# Altium schematic sheet switch_profet_btt62001.SchDoc
size A; SheetNumber: 15
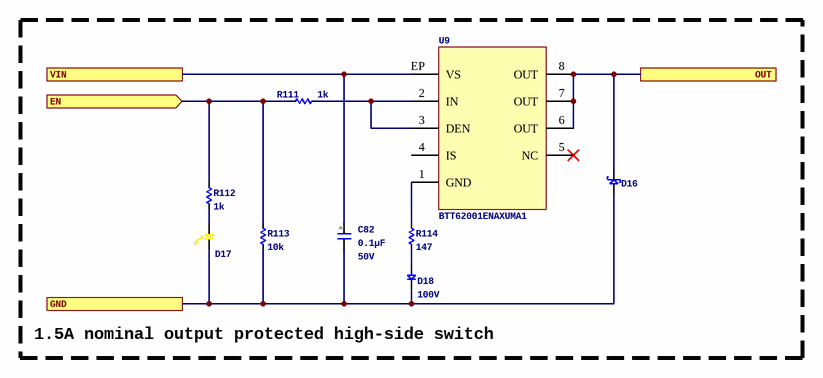
[diagram p0: switch_profet_btt62001.SchDoc]

## Parts
C82  Capacitance: 0.1µF  Voltage - Rated: 50V  [C0402_0.55MM]  (hidden comment: CGA2B3X7R1H104M050BB)
D16  15MQ040NPBF  [SMA]  (value not drawn)
D17  LTST-C190YKT  [LED_0603P_YELLOW]  (value not drawn)
D18  Voltage - DC Reverse (Vr) (Max): 100V  [SOD123]  (hidden comment: 1N4148W-TP)
R111  Resistance: 1k  [R0402_0.40MM]
R112  Resistance: 1k  [R0402_0.40MM]  (hidden comment: ERJ-2RKF1001X)
R113  Resistance: 10k  [R0402_0.40MM]
R114  Resistance: 147  [R0402_0.40MM]  (hidden comment: ERJ-2RKF1470X)
U9  BTT62001ENAXUMA1  [PG-TDSO-8-31]

## Blocks framed on the sheet
1.5A nominal output protected high-side switch: C82 D16-D18 R111-R114 U9

## Ports
EN (in), GND, OUT, VIN

## Nets
EN: R111.2 R112.2 R113.2 ; port EN
GND: C82.2 D16.1 D17.1 D18.2 R113.1 ; port GND
OUT: D16.2 U9.6(OUT) U9.7(OUT) U9.8(OUT) ; port OUT
VIN: C82.1 U9.EP(VS) ; port VIN
NetD17_2: D17.2 R112.1
NetD18_1: D18.1 R114.1
NetR111_1: R111.1 U9.2(IN) U9.3(DEN)
NetR114_2: R114.2 U9.1(GND)

Not connected (* = marked no-connect by the designer): U9 4(IS) 5(NC)*

## Notes on the sheet
- (in symbol CGA2B3X7R1H104M050BB) A

## Library data of the parts
C82 = CGA2B3X7R1H104M050BB: CAP CER 0.1UF 50V X7R 0402; Manufacturer: TDK Corporation; Unit Price (USD): 0.17; Tolerance: ±20%; ComponentLink1URL: https://product.tdk.com/info/en/catalog/datasheets/mlcc_automotive_general_en.pdf?ref_disty=digikey; ComponentLink1Description: Series Datasheet; Series: CGA; Part Status: Active; Temperature Coefficient: X7R; Operating Temperature: -55°C ~ 125°C; Applications: AEC-Q200; Mounting Type: Surface Mount, MLCC; Package / Case: 0402 (1005 Metric); Size / Dimension: 0.039" L x 0.020" W (1.00mm x 0.50mm); Thickness (Max): 0.022" (0.55mm); Supplier 1: Digikey; Supplier Part Number 1: 445-12271-1-ND; Manufacturer Part Number: CGA2B3X7R1H104M050BB
D16 = SCHOTTKY_15MQ040NPBF: DIODE SCHOTTKY 40V 3A SMA; Manufacturer: Vishay Semiconductor Diodes Division; Supplier 1: Digikey; ComponentLink1URL: https://www.vishay.com/docs/94141/vs-15mq040ntrpbf.pdf; ComponentLink1Description: Datasheet; Supplier Part Number 1: 15MQ040NPBF-ND; Manufacturer Part Number: 15MQ040NPBF
D17 = LED_0603_YELLOW_LTST-C190YKT: LED YELLOW CLEAR 0603 SMD; Manufacturer: Lite-On Inc; Supplier 1: Digikey; ComponentLink1URL: https://mm.digikey.com/Volume0/opasdata/d220001/medias/docus/1176/LTST-C190YKT.pdf; ComponentLink1Description: Datasheet; Supplier Part Number 1: 160-1184-1-ND; Manufacturer Part Number: LTST-C190YKT; Supplier 2: LCSC; Supplier Part Number 2: C125097
D18 = DIODE_1N4148WTPMSTR: DIODE SWITCH 100V 150MA SOD123; Manufacturer: Micro Commercial Co; Diode Type: Standard; Speed: Small Signal =< 200mA (Io), Any Speed; Reverse Recovery Time (trr): 4ns; Current - Reverse Leakage @ Vr: 1µA @ 75V; Capacitance @ Vr, F: 2pF @ 0V, 1MHz; Voltage - Forward (Vf) (Max) @ If: 1.25V @ 150mA; Supplier 1: Digikey; Manufacturer Part Number: 1N4148W-TP; RoHS: RoHS Compliant; Category: Discrete Semiconductor Products; Stock 1: 145222; Pricing 1: 1=0.31, 10=0.202, 25=0.132, 100=0.088, 250=0.0572, 500=0.04048, 1000=0.0286 (USD); Current - Average Rectified (Io): 150mA; Mounting Type: Surface Mount; Package / Case: SOD-123; Supplier Device Package: SOD-123; Packaging: Cut Tape (CT); ComponentLink1URL: http://61.222.192.61/mccsemi/up_pdf/1N4148W(SOD123).pdf; ComponentLink1Description: http://61.222.192.61/mccsemi/up_pdf/1N4148W(SOD123).pdf; Supplier Part Number 1: 1N4148WTPMSCT-ND
R111 = ERJ-2RKF1001X: RES SMD 1K OHM 1% 1/10W 0402; Manufacturer 1: Panasonic Electronic Components; Unit Price (USD): 0.1; Power (Watts): 0.1W, 1/10W; Temperature Coefficient: ±100ppm/°C; ComponentLink1Description: Datasheet; ComponentLink1URL: https://industrial.panasonic.com/cdbs/www-data/pdf/RDA0000/AOA0000C304.pdf; Series: ERJ; Tolerance: ±1%; Composition: Thick Film; Features: Automotive AEC-Q200; Operating Temperature: -55°C ~ 155°C; Package / Case: 0402 (1005 Metric); Supplier Device Package: 0402; Size / Dimension: 0.039" L x 0.020" W (1.00mm x 0.50mm); Height - Seated (Max): 0.016" (0.40mm); Manufacturer Part Number 1: ERJ-2RKF1001X; Supplier 1: Digikey; Supplier Part Number 1: P1.00KLCT-ND
R112 = ERJ-2RKF1001X: RES SMD 1K OHM 1% 1/10W 0402; Manufacturer: Panasonic Electronic Components; Unit Price (USD): 0.1; Power (Watts): 0.1W, 1/10W; Temperature Coefficient: ±100ppm/°C; ComponentLink1Description: Datasheet; ComponentLink1URL: https://industrial.panasonic.com/cdbs/www-data/pdf/RDA0000/AOA0000C304.pdf; Series: ERJ; Tolerance: ±1%; Composition: Thick Film; Features: Automotive AEC-Q200; Operating Temperature: -55°C ~ 155°C; Package / Case: 0402 (1005 Metric); Supplier Device Package: 0402; Size / Dimension: 0.039" L x 0.020" W (1.00mm x 0.50mm); Height - Seated (Max): 0.016" (0.40mm); Supplier 1: Digikey; Supplier Part Number 1: P1.00KLCT-ND; Manufacturer Part Number: ERJ-2RKF1001X
R113 = ERJ-2RKF1002X: RES SMD 10K OHM 1% 1/10W 0402; Manufacturer 1: Panasonic Electronic Components; Unit Price (USD): 0.1; Power (Watts): 0.1W, 1/10W; Temperature Coefficient: ±100ppm/°C; ComponentLink1Description: Datasheet; ComponentLink1URL: https://industrial.panasonic.com/cdbs/www-data/pdf/RDA0000/AOA0000C304.pdf; Series: ERJ; Tolerance: ±1%; Composition: Thick Film; Features: Automotive AEC-Q200; Operating Temperature: -55°C ~ 155°C; Package / Case: 0402 (1005 Metric); Supplier Device Package: 0402; Size / Dimension: 0.039" L x 0.020" W (1.00mm x 0.50mm); Height - Seated (Max): 0.016" (0.40mm); Manufacturer Part Number 1: ERJ-2RKF1002X; Supplier 1: Digikey; Supplier Part Number 1: P10.0KLCT-ND
R114 = ERJ-2RKF1470X: RES SMD 147 OHM 1% 1/10W 0402; Manufacturer: Panasonic Electronic Components; Unit Price (USD): 0.1; Power (Watts): 0.1W, 1/10W; Temperature Coefficient: ±100ppm/°C; ComponentLink1Description: Datasheet; ComponentLink1URL: https://industrial.panasonic.com/cdbs/www-data/pdf/RDA0000/AOA0000C304.pdf; Series: ERJ; Tolerance: ±1%; Composition: Thick Film; Features: Automotive AEC-Q200; Operating Temperature: -55°C ~ 155°C; Package / Case: 0402 (1005 Metric); Supplier Device Package: 0402; Size / Dimension: 0.039" L x 0.020" W (1.00mm x 0.50mm); Height - Seated (Max): 0.016" (0.40mm); Supplier 1: Digikey; Supplier Part Number 1: P147LCT-ND; Manufacturer Part Number: ERJ-2RKF1470X
U9 = PROFET_BTT62001ENAXUMA1: 1.5 amp high side load driver; Manufacturer: Infineon; Supplier 1: Digikey; Supplier Part Number 1: 448-BTT62001ENAXUMA1CT-ND; Manufacturer Part Number: BTT62001ENAXUMA1; ComponentLink1URL: https://www.infineon.com/dgdl/Infineon-BTT6200-1ENA-DS-v01_00-EN.pdf?fileId=5546d462636cc8fb01645f3a31f312e9; ComponentLink1Description: Datasheet; Supplier 2: LCSC; Supplier Part Number 2: C2150255